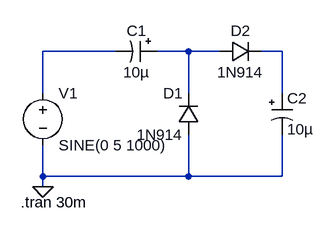
[diagram p0: schematic 3.asc]
3.asc, the LTspice schematic file:
Version 4
SHEET 1 880 680
WIRE 160 64 48 64
WIRE 272 64 224 64
WIRE 320 64 272 64
WIRE 416 64 384 64
WIRE 48 128 48 64
WIRE 272 128 272 64
WIRE 416 128 416 64
WIRE 48 256 48 208
WIRE 272 256 272 192
WIRE 272 256 48 256
WIRE 416 256 416 192
WIRE 416 256 272 256
WIRE 48 272 48 256
FLAG 48 272 0
SYMBOL voltage 48 112 R0
WINDOW 123 0 0 Left 2
WINDOW 39 0 0 Left 2
SYMATTR InstName V1
SYMATTR Value SINE(0 5 1000)
SYMBOL polcap 224 48 R90
WINDOW 0 0 32 VBottom 2
WINDOW 3 32 32 VTop 2
SYMATTR InstName C1
SYMATTR Value 10µ
SYMATTR Description Capacitor
SYMATTR Type cap
SYMATTR SpiceLine V=10 Irms=2.21565 Rser=0.055 Lser=0 mfg="KEMET" pn="A700V106M010ATE055" type="Al electrolytic"
SYMBOL diode 288 192 R180
WINDOW 0 24 64 Left 2
WINDOW 3 24 0 Left 2
SYMATTR InstName D1
SYMATTR Value 1N914
SYMBOL diode 320 80 R270
WINDOW 0 32 32 VTop 2
WINDOW 3 0 32 VBottom 2
SYMATTR InstName D2
SYMATTR Value 1N914
SYMBOL polcap 400 128 R0
WINDOW 3 24 56 Left 2
SYMATTR InstName C2
SYMATTR Value 10µ
SYMATTR Description Capacitor
SYMATTR Type cap
SYMATTR SpiceLine V=10 Irms=2.21565 Rser=0.055 Lser=0 mfg="KEMET" pn="A700V106M010ATE055" type="Al electrolytic"
TEXT 14 296 Left 2 !.tran 30m

The netlist it stands for:
* 3.asc
V1 N001 0 SINE(0 5 1000)
C1 N002 N001 10µ V=10 Irms=2.21565 Rser=0.055 Lser=0 mfg="KEMET" pn="A700V106M010ATE055" type="Al electrolytic"
D1 0 N002 1N914
D2 N002 N003 1N914
C2 N003 0 10µ V=10 Irms=2.21565 Rser=0.055 Lser=0 mfg="KEMET" pn="A700V106M010ATE055" type="Al electrolytic"
.model D D
.lib standard.dio
.tran 30m
.backanno
.end